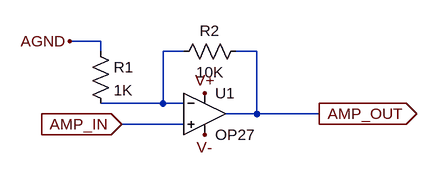
[diagram p0: schematic AmpCircuit.asc]
AmpCircuit.asc, the LTspice schematic file:
Version 4
SHEET 1 916 680
WIRE 96 32 48 32
WIRE 96 48 96 32
WIRE 224 48 192 48
WIRE 336 48 304 48
WIRE 192 128 192 48
WIRE 192 128 96 128
WIRE 224 128 192 128
WIRE 336 144 336 48
WIRE 336 144 288 144
WIRE 432 144 336 144
WIRE 224 160 128 160
FLAG 256 112 V+
FLAG 256 176 V-
FLAG 48 32 AGND
FLAG 128 160 AMP_IN
IOPIN 128 160 In
FLAG 432 144 AMP_OUT
IOPIN 432 144 Out
DATAFLAG 64 32 ""
SYMBOL res 80 32 R0
SYMATTR InstName R1
SYMATTR Value 1K
SYMATTR SpiceLine tol=1 pwr=0.1
SYMBOL res 320 32 R90
WINDOW 0 0 56 VBottom 2
WINDOW 3 32 56 VTop 2
SYMATTR InstName R2
SYMATTR Value 10K
SYMATTR SpiceLine tol=1 pwr=0.1
SYMBOL Opamps\\OP27 256 80 R0
SYMATTR InstName U1

The netlist it stands for:
* AmpCircuit.asc
R1 AGND N001 1K tol=1 pwr=0.1
R2 AMP_OUT N001 10K tol=1 pwr=0.1
XU1 AMP_IN N001 V+ V- AMP_OUT OP27  ; pins In+ In- V+ V- OUT
.lib ADI.lib
.backanno
.end